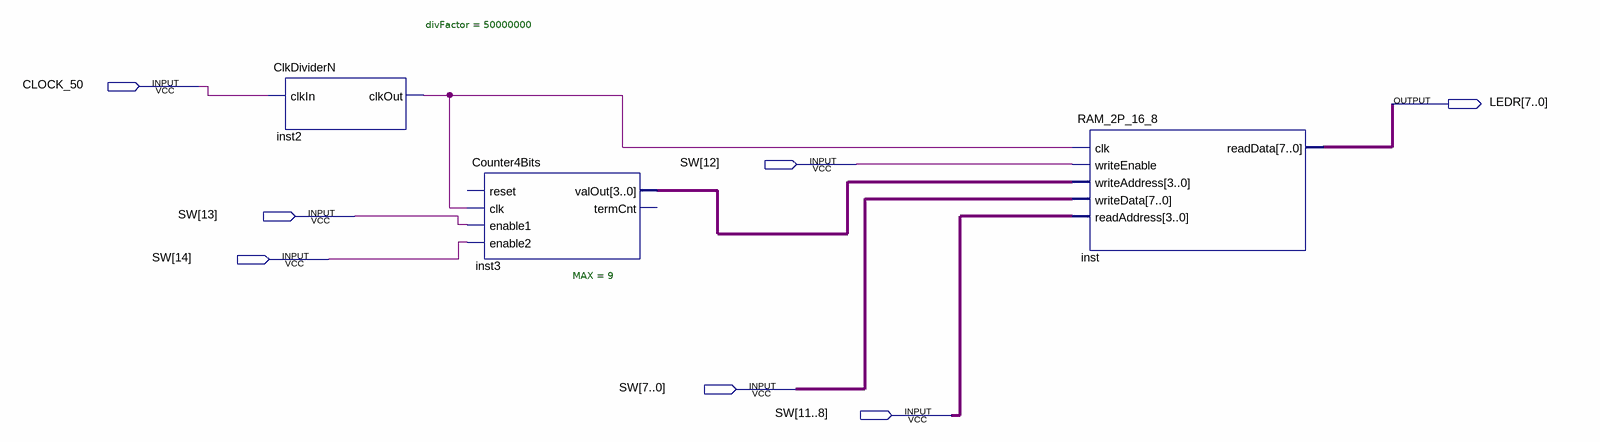
[diagram p0: schematic sheet]
// Quartus schematic RAM_2P_Demo.bdf as structural Verilog: 3 symbols, 7 pins
module RAM_2P_Demo (
  input  CLOCK_50,
  input  [14:0] SW,
  output [7:0] LEDR
);

  wire inst2_clkout;
  wire [3:0] inst3_valout;

  ClkDividerN #(.divFactor(50000000)) inst2 (.clkIn(CLOCK_50), .clkOut(inst2_clkout));
  Counter4Bits #(.MAX(9)) inst3 (
    .clk(inst2_clkout), .enable1(SW[13]), .enable2(SW[14]), .valOut(inst3_valout));  // open: reset, termCnt
  RAM_2P_16_8 inst (
    .clk(inst2_clkout), .writeEnable(SW[12]), .writeAddress(inst3_valout), .writeData(SW[7:0]),
    .readAddress(SW[11:8]), .readData(LEDR));
endmodule
